# EAGLE design Blinky_Trevor (EAGLE 8.2.1)
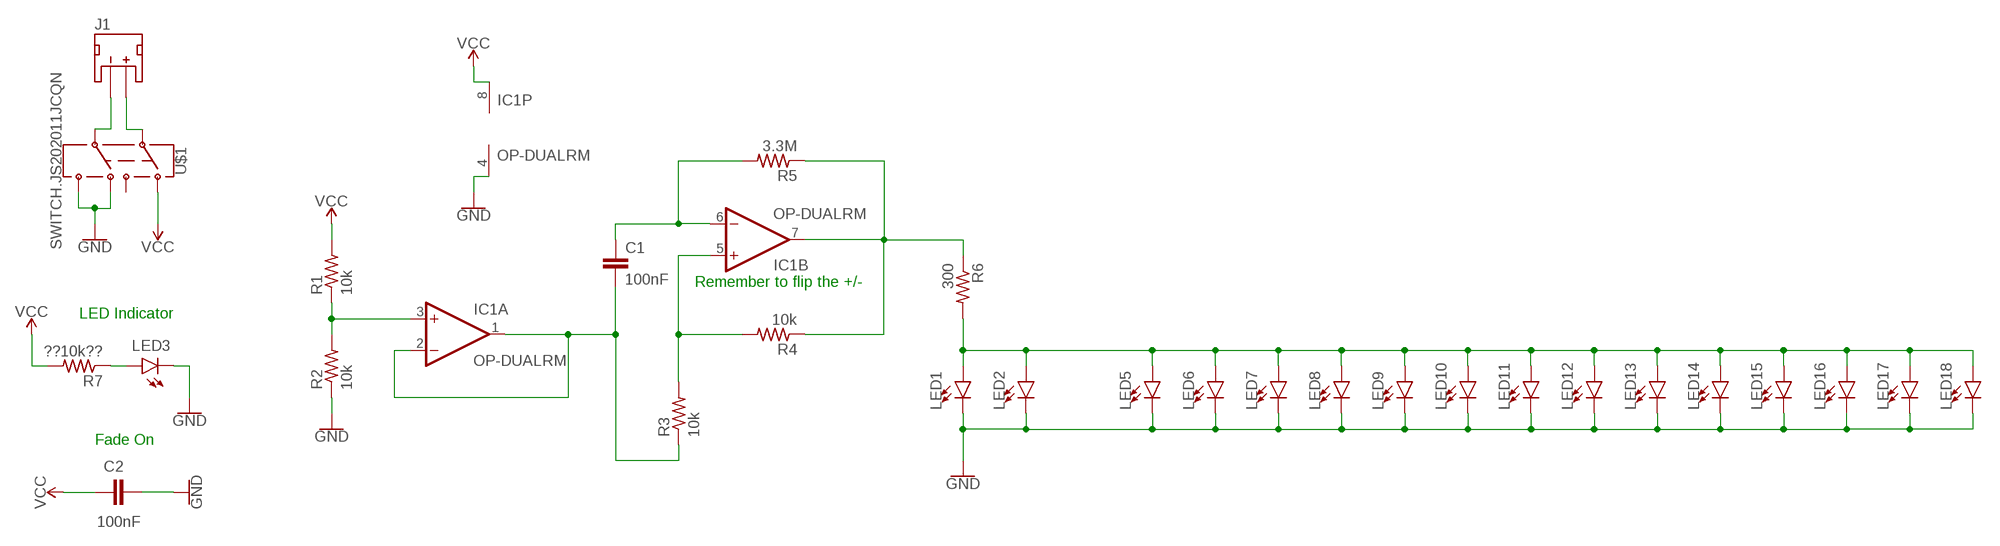
[diagram p0: schematic, sheet 1]

## Parts
C1  100nF  CAPACITOR0402  [C0402]
C2  100nF  CAPACITOR0402  [C0402]
IC1  OP-DUALRM  [MSOP08]
J1  JST_2MM_MALE  [JST-2-SMD]
LED1  LED0603  [LED-0603]
LED2  LED0603  [LED-0603]
LED3  LED0603  [LED-0603]
LED5  LED0603  [LED-0603]
LED6  LED0603  [LED-0603]
LED7  LED0603  [LED-0603]
LED8  LED0603  [LED-0603]
LED9  LED0603  [LED-0603]
LED10  LED0603  [LED-0603]
LED11  LED0603  [LED-0603]
LED12  LED0603  [LED-0603]
LED13  LED0603  [LED-0603]
LED14  LED0603  [LED-0603]
LED15  LED0603  [LED-0603]
LED16  LED0603  [LED-0603]
LED17  LED0603  [LED-0603]
LED18  LED0603  [LED-0603]
R1  10k  RESISTOR0402  [R0402]
R2  10k  RESISTOR0402  [R0402]
R3  10k  RESISTOR0402  [R0402]
R4  10k  RESISTOR0402  [R0402]
R5  3.3M  RESISTOR0402  [R0402]
R6  300  RESISTOR0402  [R0402]
R7  ??10k??  RESISTOR0402  [R0402]
U$1  SWITCH.JS202011JCQN  [SWITCH.00]

## Nets
GND: C2.2 IC1.4(P:V-) LED1.C LED2.C LED3.C LED5.C LED6.C LED7.C LED8.C LED9.C LED10.C LED11.C LED12.C LED13.C LED14.C LED15.C LED16.C LED17.C LED18.C R2.1 U$1.5 U$1.7
N$1: C1.2 IC1.1(A:OUT) IC1.2(A:-IN) R3.1
N$2: IC1.3(A:+IN) R1.1 R2.2
N$3: IC1.5(B:+IN) R3.2 R4.2
N$4: IC1.7(B:OUT) R4.1 R5.1 R6.1
N$5: C1.1 IC1.6(B:-IN) R5.2
N$6: LED1.A LED2.A LED5.A LED6.A LED7.A LED8.A LED9.A LED10.A LED11.A LED12.A LED13.A LED14.A LED15.A LED16.A LED17.A LED18.A R6.2
N$8: J1.1(-) U$1.6
N$9: J1.2(+) U$1.2
N$10: LED3.A R7.1
VCC: C2.1 IC1.8(P:V+) R1.2 R7.2 U$1.1
Unconnected: J1.NC1(PAD1) J1.NC2(PAD2) U$1.3

## Notes on the sheet
- Remember to flip the +/-
- LED Indicator
- Fade On

## Library data of the parts
C1 C2 = CalvEngIO-Passives:CAPACITOR
IC1 = CalvEngIO-AnalogIC:OP-DUAL: Precision Micropower, Low Noise CMOS, Rail-to-Rail Input/Output Operational Amplifiers Source: http://www.analog.com/static/imported-files/data_sheets/AD8603_8607_8609.pdf; MF: ALTERA CORPORATION; MPN: AD8607ARMZ-REEL; OC_FARNELL: 1464990; OC_NEWARK: 59K6925
J1 = CalvEngIO-Connectors:JST_2MM_MALE: JST 2MM MALE RA CONNECTOR Two pin, compact surface mount connector. Commonly used as a battery input connection point. We really like the solid locking feeling and high current rating on these small connectors. We use these all the time as battery connectors. Mates to single-cell LiPo batteries. Here is the connector we sell at SparkFun: JST Right Angle Connector - White <https://www.sparkfun.com/products/8612> (PRT-08612) Datasheet <http://www.sparkfun.com/datasheets/Prototyping/Connectors/JST-Horizontal.pdf> It was used on these SparkFun products: SparkFun MOSFET Power Controller <https://www.sparkfun.com/products/11214> (PRT-11214) SparkFun Battery Babysitter - LiPo Battery Manager <https://www.sparkfun.com/products/13777> (PRT-13777) And many, many others that required a lipo battery connection.; PROD_ID: CONN-11443; SF_ID: PRT-08612
LED1-LED3 LED5-LED18 = CalvEngIO-LED:LED: LED (Generic) Standard schematic elements and footprints for 5mm, 3mm, 1206, and 0603 sized LEDs. Generic LEDs with no color specified.
R1-R7 = CalvEngIO-Passives:RESISTOR
U$1 = CalvEngIO-Switches:SWITCH.JS202011JCQN

## Board
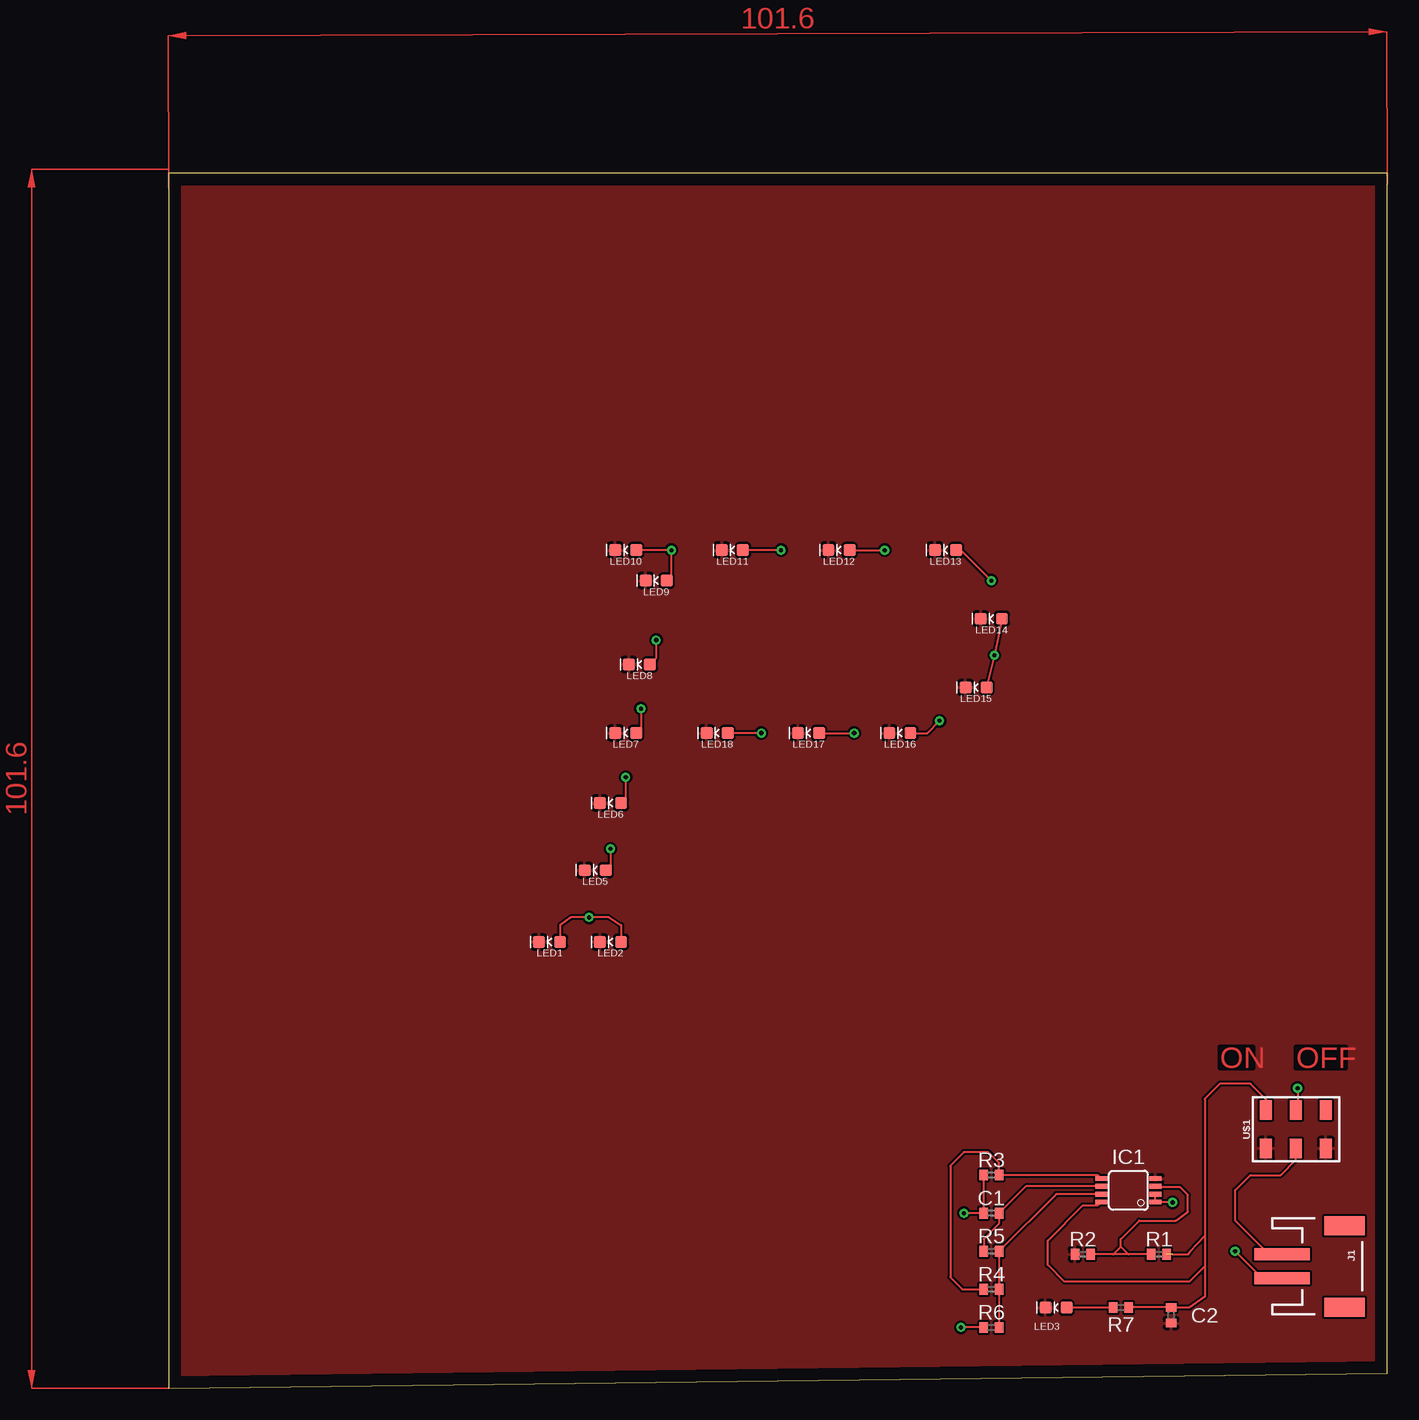
[diagram p1: board, top side]
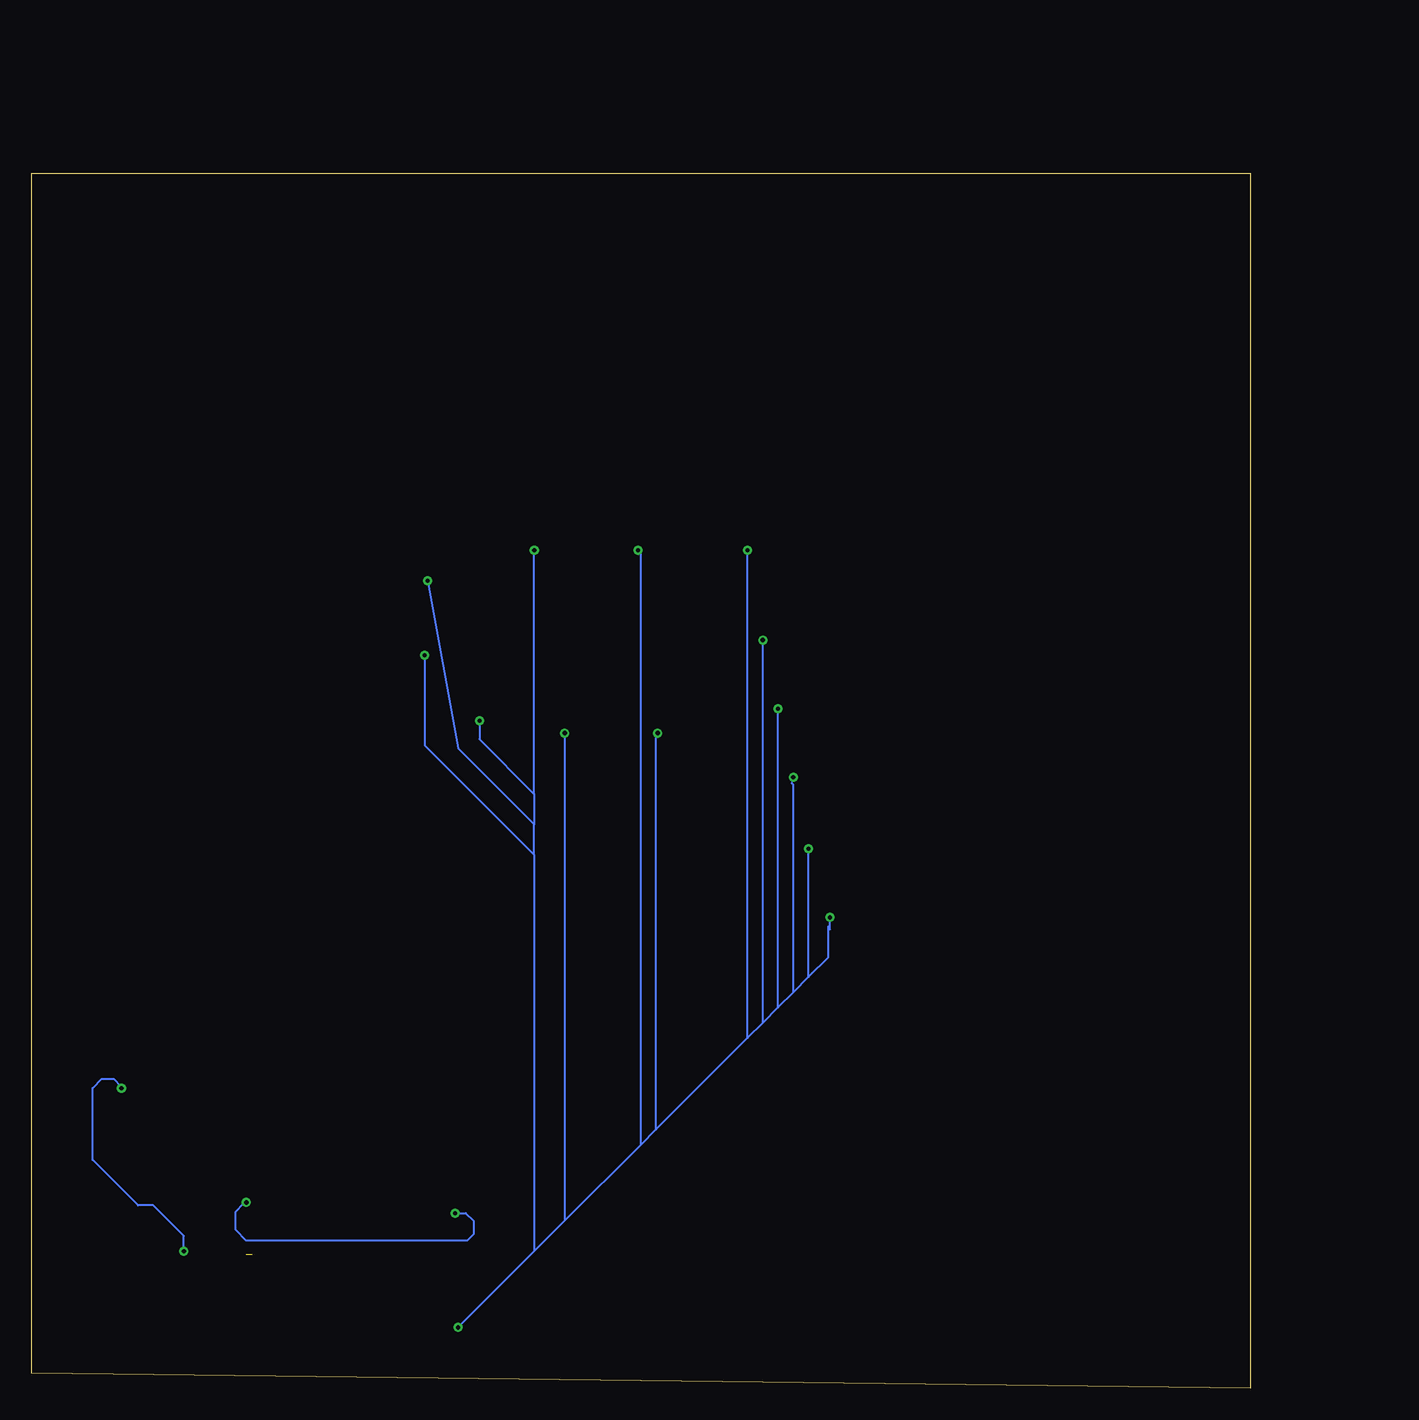
[diagram p2: board, bottom side, seen from below]

Size 101.58 x 101.27 mm. Coordinates in mm from the lower left corner, seen from the top.
Outline: 0,0 101.58,1.27 101.58,101.27 0,101.27 0,0
Copper layers (1*16): Top 0.035mm / dielectric 1.5mm / Bottom 0.035mm
Design rules "default *": minimum track width 6mil, minimum drill 0.35mm, track to track 7mil, track to pad 7mil, pad to pad 7mil, via to via 7mil, smd to smd 7mil, copper to edge 40mil, drill to drill 6mil, minimum pad ring 10mil, minimum via ring 8mil, stop-mask expansion 4mil, vias tented up to drill 0mil, thermal gap 10mil

### Footprints (pad centres in the part's own frame; a part is rotated, then mirrored left to right if it is on the bottom)
C0402 = smd 0.7 x 0.9: 1 -0.65,0; 2 0.65,0
MSOP08 = smd 0.4 x 1: 1 -0.976,-2.263; 2 -0.326,-2.263; 3 0.324,-2.263; 4 0.974,-2.263; 5 0.974,2.262; 6 0.324,2.262; 7 -0.326,2.262; 8 -0.976,2.262
JST-2-SMD = smd 1 x 4.6: 1 -1,-3.7; 2 1,-3.7 | smd 1.6 x 3.4: NC1 -3.4,1.5; NC2 3.4,1.5
LED-0603 = smd 1 x 1: A -0.877,0; C 0.877,0
R0402 = smd 0.7 x 0.9: 1 -0.65,0; 2 0.65,0
SWITCH.00 = smd 1 x 1.6: 1 -2.5,1.6; 2 0,1.6; 3 2.5,1.6; 5 -2.5,-1.6; 6 0,-1.6; 7 2.5,-1.6

### Placement (x,y rotation side)
C1  68.58,14.61 180 top
C2  83.57,6.1 270 top
IC1  80.01,16.51 90 top
J1  96.52,10.16 270 top
LED1  31.75,37.21 180 top
LED2  36.83,37.21 180 top
LED3  73.98,6.73 180 top
LED5  35.56,43.18 180 top
LED6  36.83,48.77 180 top
LED7  38.1,54.61 180 top
LED8  39.24,60.33 180 top
LED9  40.64,67.31 180 top
LED10  38.1,69.85 180 top
LED11  46.99,69.85 180 top
LED12  55.88,69.85 180 top
LED13  64.77,69.85 180 top
LED14  68.58,64.14 180 top
LED15  67.31,58.42 180 top
LED16  60.96,54.61 180 top
LED17  53.34,54.61 180 top
LED18  45.72,54.61 180 top
R1  82.55,11.18 0 top
R2  76.2,11.18 0 top
R3  68.58,17.78 0 top
R4  68.58,8.26 180 top
R5  68.58,11.43 180 top
R6  68.58,5.08 180 top
R7  79.38,6.73 0 top
U$1  93.98,21.59 0 top

### Tracks (layer width: path | path; a pad name or v marks a point on that pad's centre or on a via)
GND
  pour Top: -1.27,107.95 106.68,107.95 106.68,-2.54 105.41,-3.81 -2.54,-3.81 -3.81,-5.08 -3.81,105.41
N$1  (via drill 0.35)
  Top 0.152: IC1.2 IC1.1 82.31,15.49 v83.69,15.49 | R3.1 C1.2 v66.29,14.61
  Bottom 0.152: v66.29,14.61 65.41,14.61 64.77,13.97 64.77,12.83 65.28,12.32 83.69,12.32 84.58,13.21 84.58,14.73 83.95,15.37 83.82,15.37 v83.69,15.49
N$2
  Top 0.152: R1.1 80.01,11.18 | 80.01,11.18 78.74,11.18 | 78.74,11.18 R2.2 | 79.38,11.81 78.74,11.18 | 79.38,11.81 79.38,12.45 80.9,13.97 83.95,13.97 84.96,14.73 84.96,16.13 84.33,16.76 82.34,16.76 IC1.3 | 80.01,11.18 79.38,11.81
N$3
  Top 0.152: IC1.5 77.45,17.78 R3.2 69.23,18.78 68.33,19.68 67.31,19.68 | 67.31,19.68 67.18,19.68 | 67.31,19.68 66.29,19.68 65.15,18.54 65.15,9.27 66.17,8.26 R4.2
N$4
  Top 0.152: R6.1 R4.1 R5.1 73.98,16.18 IC1.7
N$5
  Top 0.152: IC1.6 71.46,16.83 C1.1 69.23,13.73 67.94,12.45 67.94,11.45 R5.2
N$6  (via drill 0.35)
  Top 0.152: R6.2 v66.04,5.08 | LED2.A 37.72,37.22 37.72,38.61 36.7,39.24 v35.05,39.24 33.53,39.24 32.64,38.61 32.64,37.22 LED1.A | v36.83,44.96 36.83,43.57 LED5.A | v38.1,50.93 38.1,49.16 LED6.A | v39.37,56.64 39.37,55 LED7.A | v40.64,62.36 40.64,60.84 LED8.A | LED9.A 41.91,67.7 v41.91,69.85 LED10.A | v51.05,69.85 LED11.A | v49.4,54.61 LED18.A | LED17.A v57.15,54.61 | LED12.A v59.69,69.85 | LED13.A 66.04,69.85 v68.58,67.31 | LED14.A v68.83,61.09 LED15.A | LED16.A 63.25,54.61 v64.26,55.63
  Bottom 0.152: 59.69,11.43 57.15,13.97 | 59.69,11.43 v66.04,5.08 | 57.15,13.97 50.8,20.32 | 50.8,20.32 49.53,21.59 | 49.53,21.59 41.91,29.21 | 41.91,29.21 40.64,30.48 | 40.64,30.48 39.37,31.75 | 39.37,31.75 38.1,33.02 | 38.1,33.02 36.83,34.29 | 36.83,34.29 35.18,35.94 35.18,38.48 35.05,38.23 v35.05,39.24 | 36.83,34.29 v36.83,44.96 | 38.1,33.02 38.1,50.29 38.23,50.42 v38.1,50.93 | 39.37,31.75 v39.37,56.64 39.24,56.52 | 40.64,30.48 v40.64,62.36 | 41.91,29.21 v41.91,69.85 | 49.53,21.59 49.53,54.23 49.15,54.61 v49.4,54.61 | 50.8,20.32 50.8,69.85 v51.05,69.85 | v57.15,54.61 57.15,13.97 | 59.69,49.53 59.69,46.99 | 59.69,49.53 v59.69,69.85 | 59.69,44.45 59.69,46.99 | 59.69,44.45 59.69,11.43 | v68.58,67.31 66.04,53.34 59.69,46.99 | v68.83,61.09 68.83,53.59 59.69,44.45 | v64.26,55.63 64.26,54.1 59.69,49.53
N$8
  Top 0.152: J1.1 91.71,11.16 88.9,13.97 88.9,16.51 90.17,17.78 92.71,17.78 93.98,19.05 U$1.6
N$9  (via drill 0.35)
  Top 0.152: J1.2 91.17,9.16 v88.9,11.43 | v94.11,25.02 94.11,23.32 U$1.2
  Bottom 0.152: v88.9,11.43 88.9,12.7 91.44,15.24 92.71,15.24 96.52,19.05 96.52,25.02 95.76,25.78 94.74,25.78 94.11,25.15 v94.11,25.02
N$10
  Top 0.152: R7.1 LED3.A
VCC  (1 unrouted)
  Top 0.152: U$1.1 91.48,24.09 90.17,25.4 87.63,25.4 86.36,24.13 86.36,12.7 | 86.36,12.7 85.15,11.38 84.96,11.18 83.69,11.18 | 86.36,10.16 86.36,7.62 85.09,6.73 83.71,6.73 C2.1 80.04,6.75 R7.2 80.17,6.87 | 86.36,12.7 86.36,10.16 | 86.36,10.16 85.09,8.89 74.68,8.89 73.28,10.29 73.28,12.32 76.2,15.24 77.45,15.24 IC1.8
(copper drawn outside any net)
  shapes: Top area x2

### Text on the board
Top: ON | OFF